# Altium schematic sheet 01_Power.SchDoc
size A4
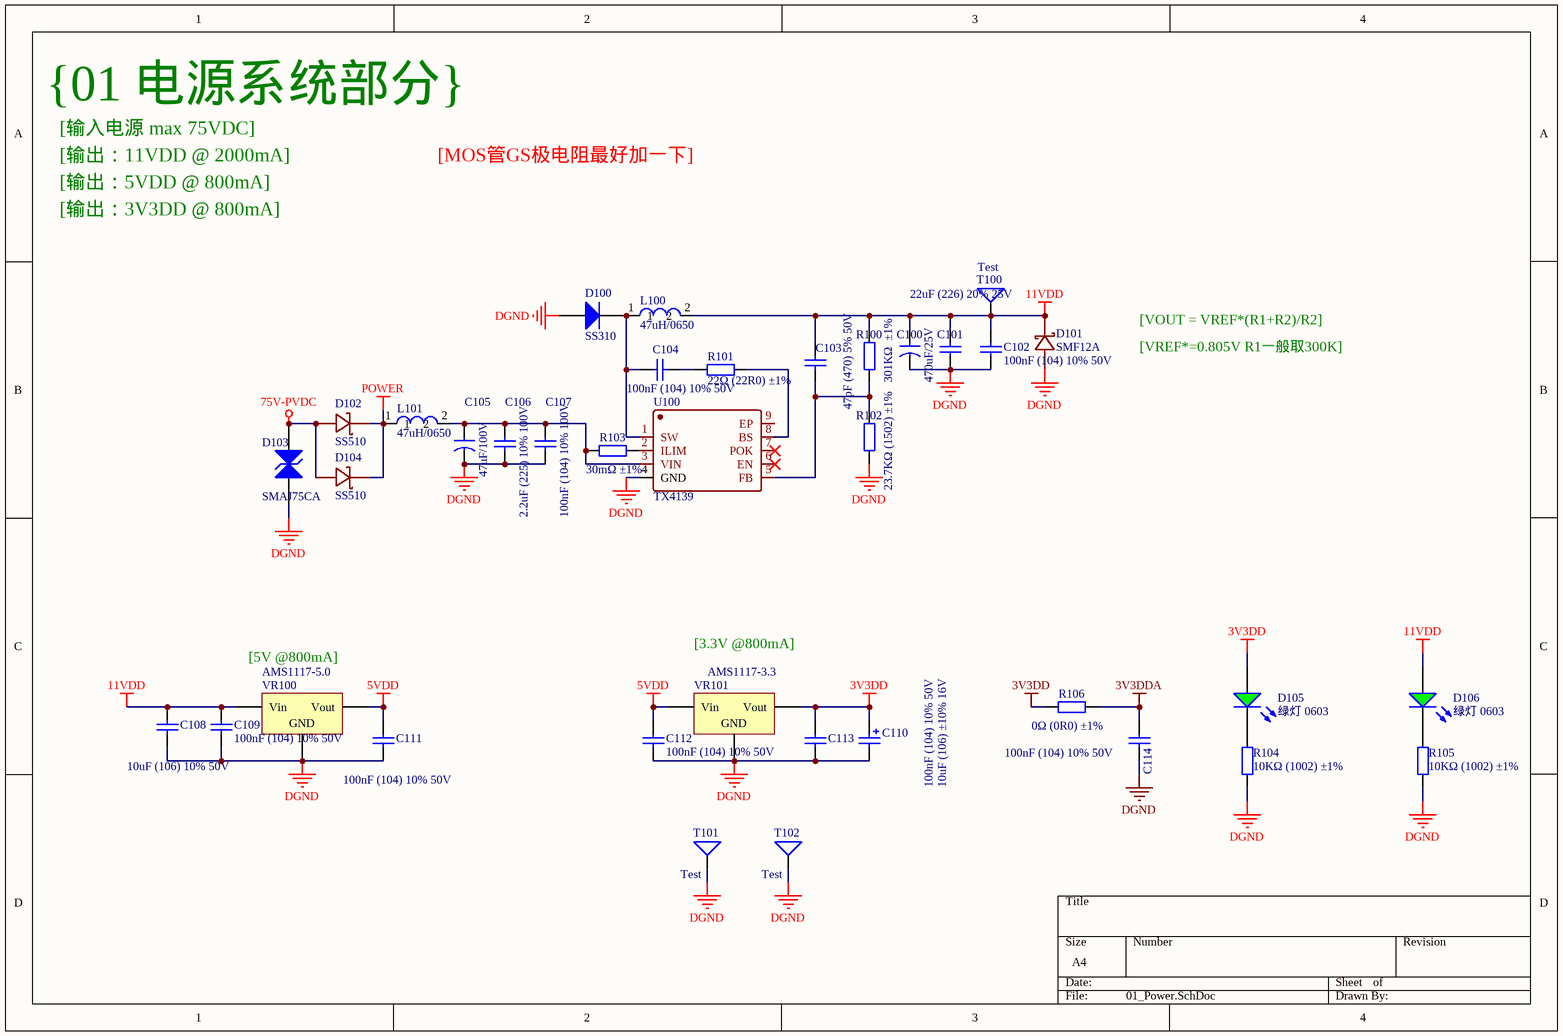
[diagram p0: 01_Power.SchDoc]

## Parts
C100  470uF/25V  [47UF/100V]
C101  22uF (226) 20% 25V  [LC-0805_C]
C102  100nF (104) 10% 50V  [LC-0603_C]
C103  47pF (470) 5% 50V  [LC-0603_C]
C104  100nF (104) 10% 50V  [LC-0603_C]
C105  47uF/100V  [47UF/100V]
C106  2.2uF (225) 10% 100V  [LC-1206_C]
C107  100nF (104) 10% 100V  [LC-1206_C]
C108  10uF (106) 10% 50V  [LC-1206_C]
C109  100nF (104) 10% 50V  [LC-0603_C]
C110  10uF (106) ±10% 16V  [LC-CASE-A_3216]
C111  100nF (104) 10% 50V  [LC-0603_C]
C112  100nF (104) 10% 50V  [LC-0603_C]
C113  100nF (104) 10% 50V  [LC-0603_C]
C114  100nF (104) 10% 50V  [LC-0603_C]
D100  SS310  [LC-SMA(DO-214AC)_S1]
D101  SMF12A  [SMF12A - duplicate]
D102  SS510  [SS510]
D103  SMAJ75CA  [LC-SMB(DO-214AA)_S1]
D104  SS510  [SS510]
D105  绿灯 0603  [LC-0603_LED_S1]
D106  绿灯 0603  [LC-0603_LED_S1]
L100  47uH/0650  [0650_47uH]
L101  47uH/0650  [0650_47uH]
R100  301KΩ  ±1%  [LC-0603_R]
R101  22Ω (22R0) ±1%  [LC-0603_R]
R102  23.7KΩ (1502) ±1%  [LC-0603_R]
R103  30mΩ ±1%  [LC-0603_R]
R104  10KΩ (1002) ±1%  [LC-0603_R]
R105  10KΩ (1002) ±1%  [LC-0603_R]
R106  0Ω (0R0) ±1%  [LC-0603_R]
T100  Test  [Testpoint]
T101  Test  [Testpoint]
T102  Test  [Testpoint]
U100  TX4139  [ESOP8]
VR100  AMS1117-5.0  [LC-SOT-223]
VR101  AMS1117-3.3  [LC-SOT-223]

## Nets
3V3DD: C110.1 C113.2 D105.A R106.1 VR101.2(Vout)
3V3DDA: C114.2 R106.2
5VDD: C111.2 C112.2 VR100.2(Vout) VR101.3(Vin)
11VDD: C100.1 C101.2 C102.2 C103.2 C108.2 C109.2 D101.1(K) D106.A L100.2 R100.2 T100.1 VR100.3(Vin)
75V-PVDC: D102.2 D103.2(K) D104.2
DGND: C100.2 C101.1 C102.1 C105.2 C106.1 C107.1 C108.1 C109.1 C110.2 C111.1 C112.1 C113.1 C114.1 D100.1(A) D101.2(A) D103.1(A) R102.1 R104.1 R105.1 T101.1 T102.1 U100.4(GND) VR100.1(GND) VR101.1(GND)
POWER: D102.1 D104.1 L101.1
NetC103_1: C103.1 R100.1 R102.2 U100.5(FB)
NetC104_1: C104.1 D100.2(K) L100.1 U100.1(SW)
NetC104_2: C104.2 R101.1
NetC105_1: C105.1 C106.2 C107.2 L101.2 R103.2 U100.3(VIN)
NetD105_K: D105.K R104.2
NetD106_K: D106.K R105.2
NetR101_2: R101.2 U100.8(BS)
NetR103_1: R103.1 U100.2(ILIM)

Not connected (* = marked no-connect by the designer): U100 6(EN)* 7(POK)* 9(EP)

## Notes on the sheet
- {01 电源系统部分}
- [输入电源 max 75VDC]
- [输出：11VDD @ 2000mA]
- [MOS管GS极电阻最好加一下]
- [输出：5VDD @ 800mA]
- [输出：3V3DD @ 800mA]
- [VOUT = VREF*(R1+R2)/R2]
- [VREF*=0.805V R1一般取300K]
- [3.3V @800mA]
- [5V @800mA]

## Library data of the parts
C100 C105 = CapSMT220u_16V
C101 = 0805 22uF (226) 20% 25V: 贴片电容; ComponentLink1Description: 供应商链接; ComponentLink1URL: http://www.szlcsc.com/product/details_46786.html; Package: 0805; Supplier: LC; SuppliersPartNumber: C45783
C102 C104 C109 C111-C114 = 0603 100nF (104) 10% 50V: 贴片电容; ComponentLink1Description: 供应商链接; ComponentLink1URL: http://www.szlcsc.com/product/details_15331.html; Package: 0603; Supplier: LC; SuppliersPartNumber: C14663
C103 = 0603 47pF (470) 5% 50V: 贴片电容; ComponentLink1Description: 供应商链接; ComponentLink1URL: http://www.szlcsc.com/product/details_2023.html; Package: 0603; Supplier: LC; SuppliersPartNumber: C1671
C106 = 1206 2.2uF (225) 10% 50V: 贴片电容; ComponentLink1Description: 供应商链接; ComponentLink1URL: http://www.szlcsc.com/product/details_13292.html; Package: 1206; Supplier: LC; SuppliersPartNumber: C12656
C107 = 1206 100nF (104) 10% 50V: 贴片电容; ComponentLink1Description: 供应商链接; ComponentLink1URL: http://www.szlcsc.com/product/details_25237.html; Package: 1206; Supplier: LC; SuppliersPartNumber: C24497
C108 = 1206 10uF (106) 10% 50V: 贴片电容; ComponentLink1Description: 供应商链接; ComponentLink1URL: http://www.szlcsc.com/product/details_14236.html; Package: 1206; Supplier: LC; SuppliersPartNumber: C13585
C110 = 3216 10uF (106) 10% 16V: 钽电容; ComponentLink1Description: 供应商链接; ComponentLink1URL: http://www.szlcsc.com/product/details_7643.html; Package: 3216; Supplier: LC; SuppliersPartNumber: C7171
D100 = SMA(DO-214AC) SS54: 二极管; ComponentLink1Description: 供应商链接; ComponentLink1URL: http://www.szlcsc.com/product/details_23178.html; Package: SMA(DO-214AC); Supplier: LC; SuppliersPartNumber: C22452
D103 = SMB/DO-214AA P6SMB6.8CA: TVS; ComponentLink1Description: 供应商链接; ComponentLink1URL: http://www.szlcsc.com/product/details_79530.html; Package: SMB/DO-214AA; Supplier: LC; SuppliersPartNumber: C78395
D105 D106 = 0603 绿灯: 发光二极管; ComponentLink1Description: 供应商链接; ComponentLink1URL: http://www.szlcsc.com/product/details_73152.html; Package: 0603; Supplier: LC; SuppliersPartNumber: C72043
L100 L101 = Inductor
R100 = 0603 330KΩ (3303) 1%: 贴片电阻; ComponentLink1Description: 供应商链接; ComponentLink1URL: http://www.szlcsc.com/product/details_23864.html; Package: 0603; Supplier: LC; SuppliersPartNumber: C23137
R101 = 0603 22Ω (22R0) 1%: 贴片电阻; ComponentLink1Description: 供应商链接; ComponentLink1URL: http://www.szlcsc.com/product/details_24078.html; Package: 0603; Supplier: LC; SuppliersPartNumber: C23345
R102 = 0603 15KΩ (1502) 1%: 贴片电阻; ComponentLink1Description: 供应商链接; ComponentLink1URL: http://www.szlcsc.com/product/details_23536.html; Package: 0603; Supplier: LC; SuppliersPartNumber: C22809
R103 = 0603 100KΩ (1003) 1%: 贴片电阻; ComponentLink1Description: 供应商链接; ComponentLink1URL: http://www.szlcsc.com/product/details_26546.html; Package: 0603; Supplier: LC; SuppliersPartNumber: C25803
R104 R105 = 0603 10KΩ (1002) 1%: 贴片电阻; ComponentLink1Description: 供应商链接; ComponentLink1URL: http://www.szlcsc.com/product/details_26547.html; Package: 0603; Supplier: LC; SuppliersPartNumber: C25804
R106 = 0603 0Ω (0R0) 1%: 贴片电阻; ComponentLink1Description: 供应商链接; ComponentLink1URL: http://www.szlcsc.com/product/details_21903.html; Package: 0603; Supplier: LC; SuppliersPartNumber: C21189
T100-T102 = TestPad
VR100 = SOT-223 AMS1117-5.0: 低压差线性稳压(LDO); ComponentLink1Description: 供应商链接; ComponentLink1URL: http://www.szlcsc.com/product/details_6653.html; Package: SOT-223; Supplier: LC; SuppliersPartNumber: C6187
VR101 = SOT-223 AMS1117-3.3: 低压差线性稳压(LDO); ComponentLink1Description: 供应商链接; ComponentLink1URL: http://www.szlcsc.com/product/details_6652.html; Package: SOT-223; Supplier: LC; SuppliersPartNumber: C6186